# EAGLE design S-Puck-no_mcu (EAGLE 7.4.0)
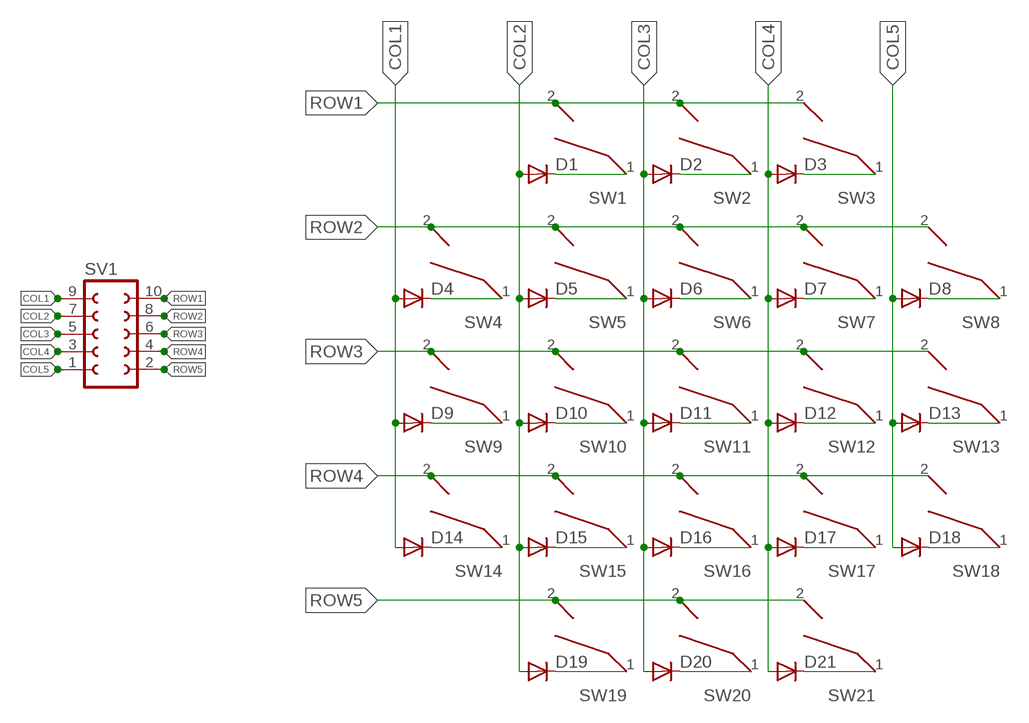
[diagram p0: schematic, sheet 1]

## Parts
D1  1N4148DO35-10  [DO35-10]
D2  1N4148DO35-10  [DO35-10]
D3  1N4148DO35-10  [DO35-10]
D4  1N4148DO35-10  [DO35-10]
D5  1N4148DO35-10  [DO35-10]
D6  1N4148DO35-10  [DO35-10]
D7  1N4148DO35-10  [DO35-10]
D8  1N4148DO35-10  [DO35-10]
D9  1N4148DO35-10  [DO35-10]
D10  1N4148DO35-10  [DO35-10]
D11  1N4148DO35-10  [DO35-10]
D12  1N4148DO35-10  [DO35-10]
D13  1N4148DO35-10  [DO35-10]
D14  1N4148DO35-10  [DO35-10]
D15  1N4148DO35-10  [DO35-10]
D16  1N4148DO35-10  [DO35-10]
D17  1N4148DO35-10  [DO35-10]
D18  1N4148DO35-10  [DO35-10]
D19  1N4148DO35-10  [DO35-10]
D20  1N4148DO35-10  [DO35-10]
D21  1N4148DO35-10  [DO35-10]
SV1  FE05-2  [FE05-2]
SW1  CHERRY_MX_WITH_FIXING_PINS  [MX1A-XXNW]
SW2  CHERRY_MX_WITH_FIXING_PINS  [MX1A-XXNW]
SW3  CHERRY_MX_WITH_FIXING_PINS  [MX1A-XXNW]
SW4  CHERRY_MX_WITH_FIXING_PINS  [MX1A-XXNW]
SW5  CHERRY_MX_WITH_FIXING_PINS  [MX1A-XXNW]
SW6  CHERRY_MX_WITH_FIXING_PINS  [MX1A-XXNW]
SW7  CHERRY_MX_WITH_FIXING_PINS  [MX1A-XXNW]
SW8  CHERRY_MX_WITH_FIXING_PINS  [MX1A-XXNW]
SW9  CHERRY_MX_WITH_FIXING_PINS  [MX1A-XXNW]
SW10  CHERRY_MX_WITH_FIXING_PINS  [MX1A-XXNW]
SW11  CHERRY_MX_WITH_FIXING_PINS  [MX1A-XXNW]
SW12  CHERRY_MX_WITH_FIXING_PINS  [MX1A-XXNW]
SW13  CHERRY_MX_WITH_FIXING_PINS  [MX1A-XXNW]
SW14  CHERRY_MX_WITH_FIXING_PINS  [MX1A-XXNW]
SW15  CHERRY_MX_WITH_FIXING_PINS  [MX1A-XXNW]
SW16  CHERRY_MX_WITH_FIXING_PINS  [MX1A-XXNW]
SW17  CHERRY_MX_WITH_FIXING_PINS  [MX1A-XXNW]
SW18  CHERRY_MX_WITH_FIXING_PINS  [MX1A-XXNW]
SW19  CHERRY_MX_WITH_FIXING_PINS  [MX1A-XXNW]
SW20  CHERRY_MX_WITH_FIXING_PINS  [MX1A-XXNW]
SW21  CHERRY_MX_WITH_FIXING_PINS  [MX1A-XXNW]

## Nets
COL1: D4.A D9.A D14.A SV1.9
COL2: D1.A D5.A D10.A D15.A D19.A SV1.7
COL3: D2.A D6.A D11.A D16.A D20.A SV1.5
COL4: D3.A D7.A D12.A D17.A D21.A SV1.3
COL5: D8.A D13.A D18.A SV1.1
N$1: D1.C SW1.1
N$2: D2.C SW2.1
N$3: D3.C SW3.1
N$4: D4.C SW4.1
N$5: D5.C SW5.1
N$6: D6.C SW6.1
N$7: D7.C SW7.1
N$8: D8.C SW8.1
N$9: D9.C SW9.1
N$10: D10.C SW10.1
N$11: D11.C SW11.1
N$12: D12.C SW12.1
N$13: D13.C SW13.1
N$14: D14.C SW14.1
N$15: D15.C SW15.1
N$16: D16.C SW16.1
N$17: D17.C SW17.1
N$18: D18.C SW18.1
N$19: D19.C SW19.1
N$20: D20.C SW20.1
N$21: D21.C SW21.1
ROW1: SV1.10 SW1.2 SW2.2 SW3.2
ROW2: SV1.8 SW4.2 SW5.2 SW6.2 SW7.2 SW8.2
ROW3: SV1.6 SW9.2 SW10.2 SW11.2 SW12.2 SW13.2
ROW4: SV1.4 SW14.2 SW15.2 SW16.2 SW17.2 SW18.2
ROW5: SV1.2 SW19.2 SW20.2 SW21.2

## Library data of the parts
D1-D21 = diode:1N4148: DIODE high speed (Philips)
SV1 = con-lsta:FE05-2: FEMALE HEADER; OC_FARNELL: unknown; OC_NEWARK: unknown
SW1-SW21 = Cherry_MX_v7.0:CHERRY_MX

## Board
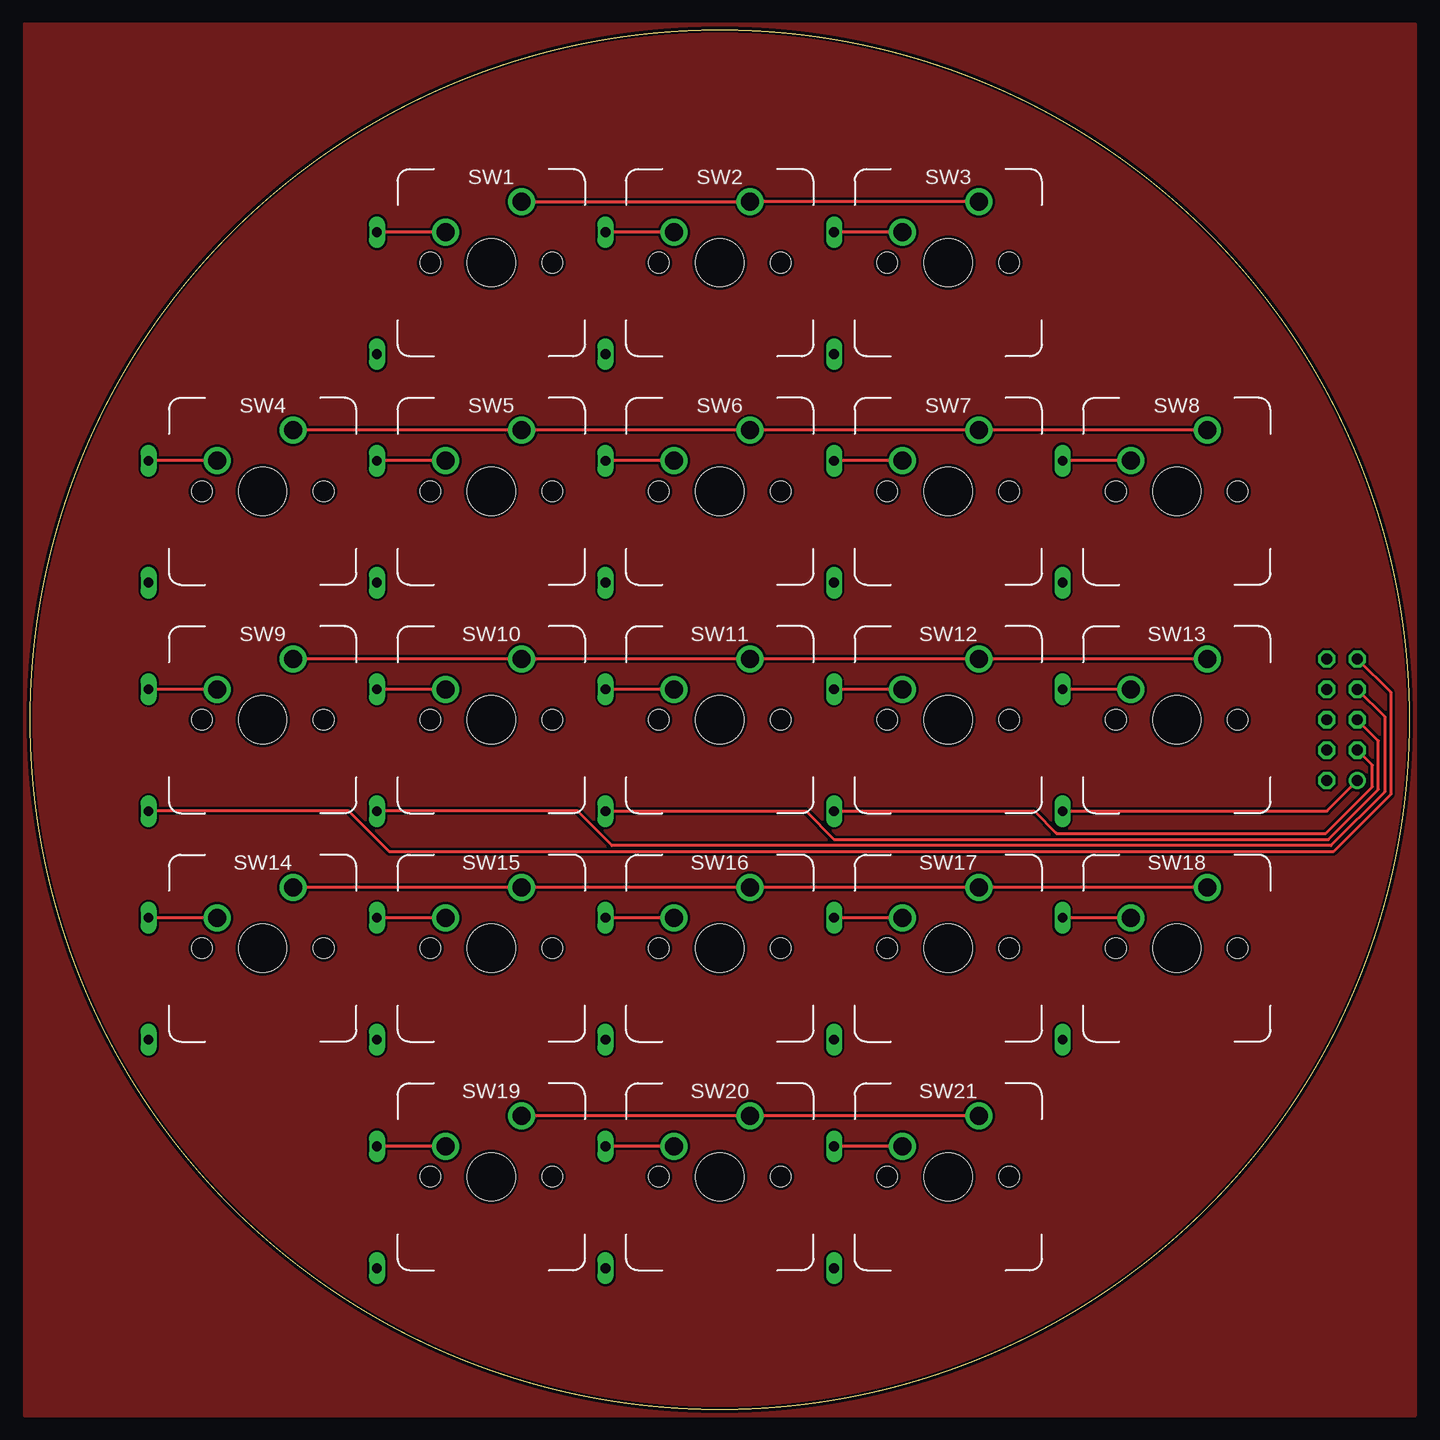
[diagram p1: board, top side]
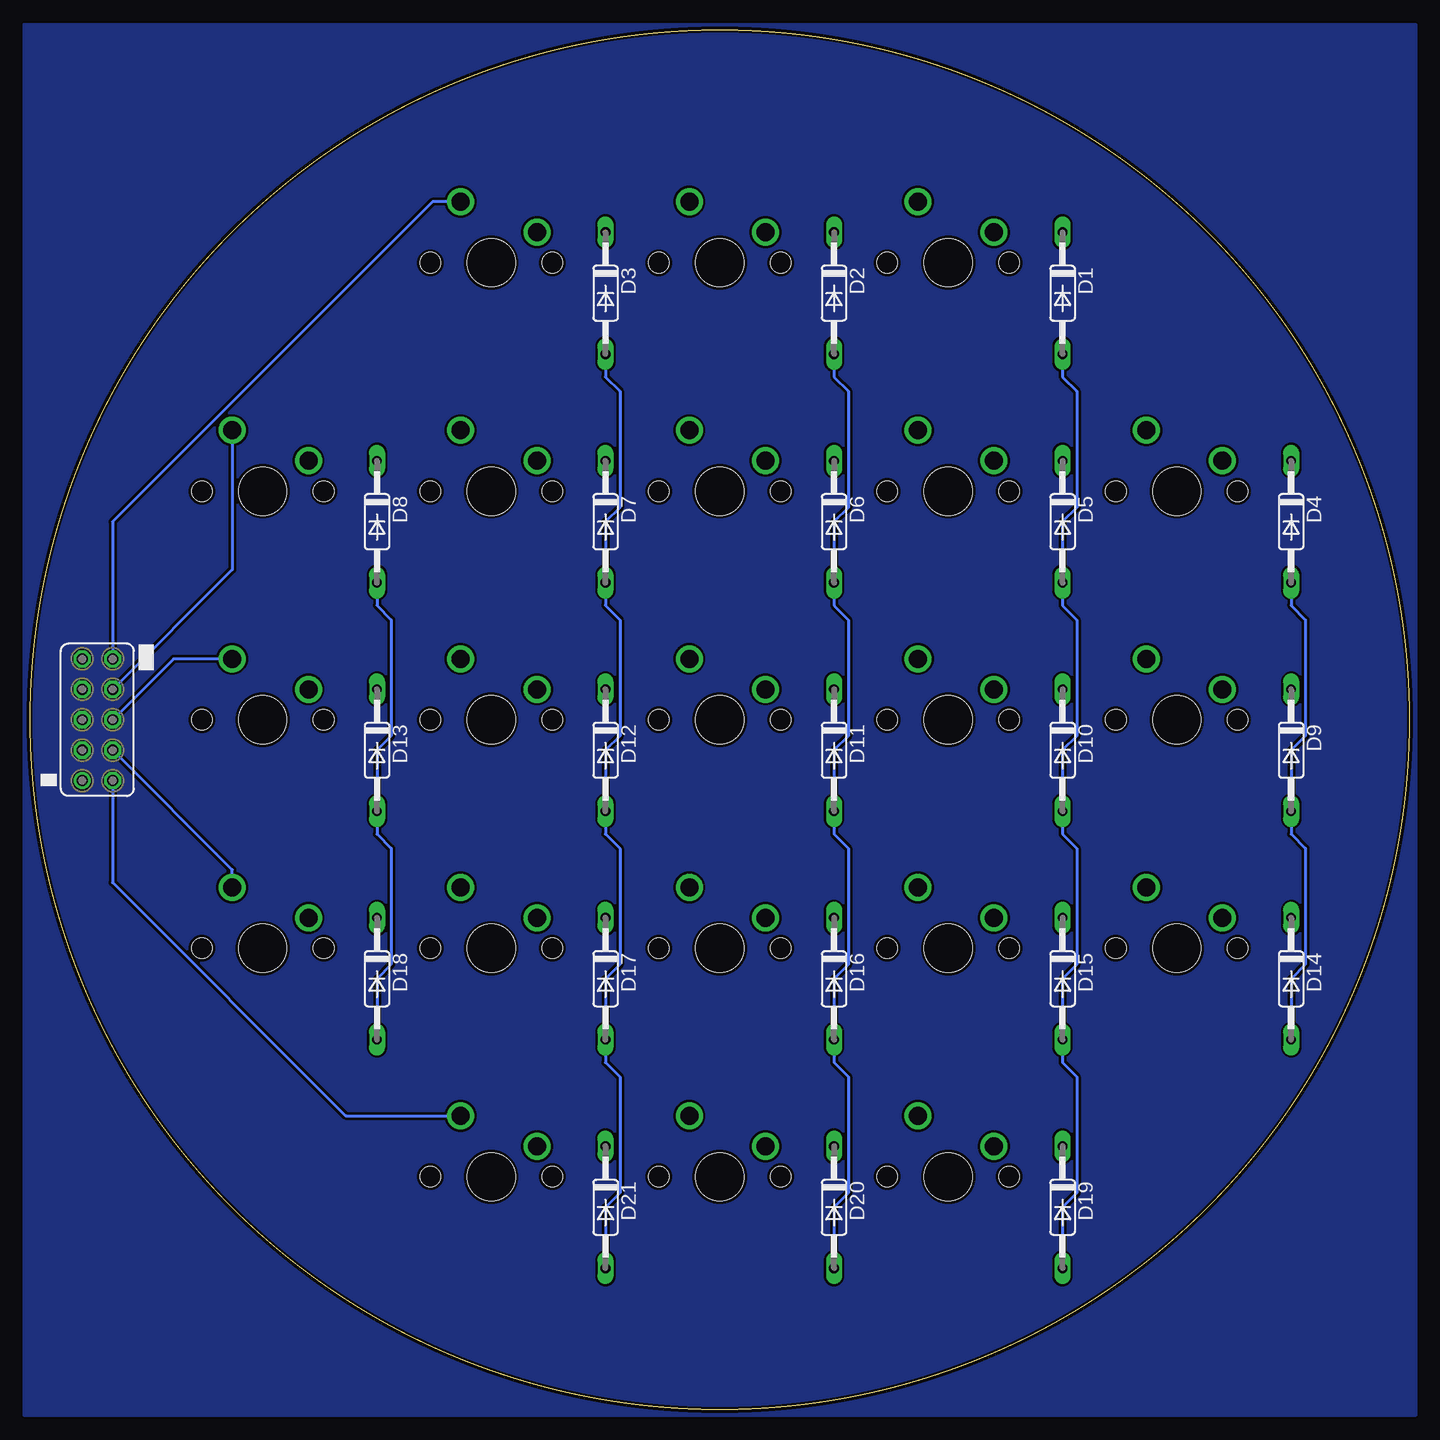
[diagram p2: board, bottom side, seen from below]

Size 115 x 115 mm. Coordinates in mm from the lower left corner, seen from the top.
Outline: circle at 57.5,57.5 radius 57.5
Copper layers (1*16): Top 0.035mm / dielectric 1.5mm / Bottom 0.035mm
Design rules "default *": minimum track width 10mil, minimum drill 24mil, track to track 8mil, track to pad 8mil, pad to pad 8mil, via to via 8mil, smd to smd 8mil, copper to edge 10mil, drill to drill 8mil, minimum pad ring 10mil, minimum via ring 8mil, stop-mask expansion 4mil, vias tented up to drill 0mil, thermal gap 10mil

### Footprints (pad centres in the part's own frame; a part is rotated, then mirrored left to right if it is on the bottom)
DO35-10 = drill 0.813 long: A 5.08,0; C -5.08,0
FE05-2 = drill 0.914: 1 -5.08,1.27 | drill 0.914 octagon: 2 -5.08,-1.27; 3 -2.54,1.27; 4 -2.54,-1.27; 5 0,1.27; 6 0,-1.27; 7 2.54,1.27; 8 2.54,-1.27; 9 5.08,1.27; 10 5.08,-1.27
MX1A-XXNW = drill 1.5: 1 -3.81,2.54; 2 2.54,5.08 | hole 4: 0,0 | hole 1.7: -5.08,0; 5.08,0

### Placement (x,y rotation side)
D1  28.93,93.06 270 bottom
D2  47.98,93.06 270 bottom
D3  67.03,93.06 270 bottom
D4  9.88,74.01 270 bottom
D5  28.93,74.01 270 bottom
D6  47.98,74.01 270 bottom
D7  67.03,74.01 270 bottom
D8  86.08,74.01 270 bottom
D9  9.88,54.96 270 bottom
D10  28.93,54.96 270 bottom
D11  47.98,54.96 270 bottom
D12  67.03,54.96 270 bottom
D13  86.08,54.96 270 bottom
D14  9.88,35.91 270 bottom
D15  28.93,35.91 270 bottom
D16  47.98,35.91 270 bottom
D17  67.03,35.91 270 bottom
D18  86.08,35.91 270 bottom
D19  28.93,16.86 270 bottom
D20  47.98,16.86 270 bottom
D21  67.03,16.86 270 bottom
SV1  109.38,57.5 90 bottom
SW1  38.45,95.6 0 top
SW2  57.5,95.6 0 top
SW3  76.55,95.6 0 top
SW4  19.4,76.55 0 top
SW5  38.45,76.55 0 top
SW6  57.5,76.55 0 top
SW7  76.55,76.55 0 top
SW8  95.6,76.55 0 top
SW9  19.4,57.5 0 top
SW10  38.45,57.5 0 top
SW11  57.5,57.5 0 top
SW12  76.55,57.5 0 top
SW13  95.6,57.5 0 top
SW14  19.4,38.45 0 top
SW15  38.45,38.45 0 top
SW16  57.5,38.45 0 top
SW17  76.55,38.45 0 top
SW18  95.6,38.45 0 top
SW19  38.45,19.4 0 top
SW20  57.5,19.4 0 top
SW21  76.55,19.4 0 top

### Tracks (layer width: path | path; a pad name or v marks a point on that pad's centre or on a via)
COL1
  Top 0.254: SV1.9 113.43,59.8 113.43,51.27 108.66,46.49 29.96,46.49 26.57,49.88 D9.A
  Bottom 0.254: D4.A 9.88,67.03 8.68,65.83 8.68,56.16 9.88,54.96 D9.A 9.88,47.98 8.68,46.78 8.68,37.11 9.88,35.91 D14.A
COL2
  Top 0.254: SV1.7 112.92,57.77 112.92,51.48 108.44,47.01 48.5,47.01 45.62,49.88 D10.A
  Bottom 0.254: D1.A 28.93,86.08 27.73,84.88 27.73,75.2 28.93,74.01 D5.A 28.93,67.03 27.73,65.83 27.73,56.16 28.93,54.96 D10.A 28.93,47.98 27.73,46.78 27.73,37.11 28.93,35.91 D15.A 28.93,28.93 27.73,27.73 27.73,18.05 28.93,16.86 D19.A
COL3
  Top 0.254: D11.A 64.67,49.88 67.03,47.52 108.23,47.52 112.41,51.69 112.41,55.74 SV1.5
  Bottom 0.254: D2.A 47.98,86.08 46.78,84.88 46.78,75.2 47.98,74.01 D6.A 47.98,67.03 46.78,65.83 46.78,56.16 47.98,54.96 D11.A 47.98,47.98 46.78,46.78 46.78,37.11 47.98,35.91 D16.A 47.98,28.93 46.78,27.73 46.78,18.05 47.98,16.86 D20.A
COL4
  Top 0.254: D12.A 83.72,49.88 85.58,48.02 108.03,48.02 111.9,51.9 111.9,53.72 SV1.3
  Bottom 0.254: D3.A 67.03,86.08 65.83,84.88 65.83,75.2 67.03,74.01 D7.A 67.03,67.03 65.83,65.83 65.83,56.16 67.03,54.96 D12.A 67.03,47.98 65.83,46.78 65.83,37.11 67.03,35.91 D17.A 67.03,28.93 65.83,27.73 65.83,18.05 67.03,16.86 D21.A
COL5
  Top 0.254: D13.A 108.12,49.88 SV1.1
  Bottom 0.254: D8.A 86.08,67.03 84.88,65.83 84.88,56.16 86.08,54.96 D13.A 86.08,47.98 84.88,46.78 84.88,37.11 86.08,35.91 D18.A
GND
  pour Bottom: -0.5,-0.5 115.5,-0.5 115.5,115.5 -0.5,115.5
  pour Top: 56.5,-0.5 115.5,-0.5 115.5,59.5 115.5,115.5 56.5,115.5 -0.5,115.5 -0.5,56.5 -0.5,-0.5
N$1
  Top 0.254: SW1.1 D1.C
N$2
  Top 0.254: SW2.1 D2.C
N$3
  Top 0.254: SW3.1 D3.C
N$4
  Top 0.254: SW4.1 D4.C
N$5
  Top 0.254: SW5.1 D5.C
N$6
  Top 0.254: SW6.1 D6.C
N$7
  Top 0.254: SW7.1 D7.C
N$8
  Top 0.254: SW8.1 D8.C
N$9
  Top 0.254: SW9.1 D9.C
N$10
  Top 0.254: SW10.1 D10.C
N$11
  Top 0.254: SW11.1 D11.C
N$12
  Top 0.254: SW12.1 D12.C
N$13
  Top 0.254: SW13.1 D13.C
N$14
  Top 0.254: SW14.1 D14.C
N$15
  Top 0.254: SW15.1 D15.C
N$16
  Top 0.254: SW16.1 D16.C
N$17
  Top 0.254: SW17.1 D17.C
N$18
  Top 0.254: SW18.1 D18.C
N$19
  Top 0.254: SW19.1 D19.C
N$20
  Top 0.254: SW20.1 D20.C
N$21
  Top 0.254: SW21.1 D21.C
ROW1
  Top 0.254: SW1.2 SW2.2 SW3.2
  Bottom 0.254: SW3.2 81.44,100.68 108.12,74 SV1.10
ROW2
  Top 0.254: SW8.2 SW7.2 SW6.2 SW5.2 SW4.2
  Bottom 0.254: SW8.2 98.14,70.02 SV1.8
ROW3
  Top 0.254: SW13.2 SW12.2 SW11.2 SW10.2 SW9.2
  Bottom 0.254: SW13.2 103.03,62.58 SV1.6
ROW4
  Top 0.254: SW18.2 SW17.2 SW16.2 SW15.2 SW14.2
  Bottom 0.254: SW18.2 98.14,44.98 SV1.4
ROW5
  Top 0.254: SW21.2 SW20.2 SW19.2
  Bottom 0.254: SV1.2 108.12,43.92 88.67,24.48 SW21.2

### Text on the board
bDocu: ROW | COLUMN | 1 | 2 | 3 | 4 | 5 | S-Puck